# Altium schematic sheet dsPIC_filter.SchDoc
size B
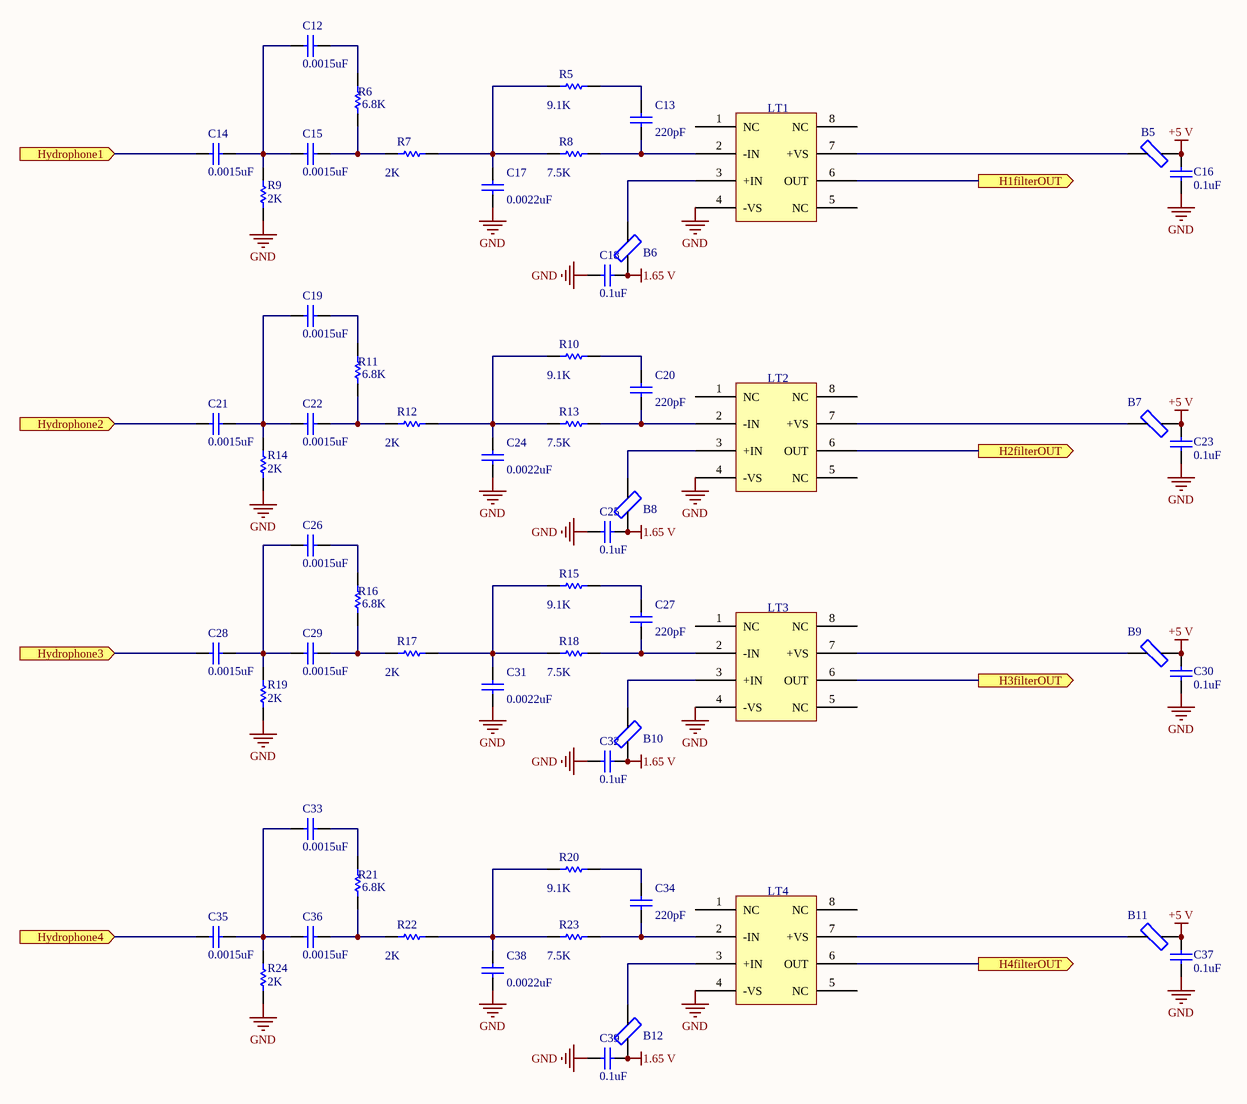
[diagram p0: dsPIC_filter.SchDoc]

## Parts
B5  Ferrite Bead  [Capacitor 0603]  (value not drawn)
B6  Ferrite Bead  [Capacitor 0603]  (value not drawn)
B7  Ferrite Bead  [Capacitor 0603]  (value not drawn)
B8  Ferrite Bead  [Capacitor 0603]  (value not drawn)
B9  Ferrite Bead  [Capacitor 0603]  (value not drawn)
B10  Ferrite Bead  [Capacitor 0603]  (value not drawn)
B11  Ferrite Bead  [Capacitor 0603]  (value not drawn)
B12  Ferrite Bead  [Capacitor 0603]  (value not drawn)
C12  0.0015uF  [Capacitor 0603]
C13  220pF  [Capacitor 0603]
C14  0.0015uF  [Capacitor 0603]
C15  0.0015uF  [Capacitor 0603]
C16  value 0.1uF  [C1206]  (hidden comment: .1uF 20V Ceramic Low ESR)
C17  0.0022uF  [Capacitor 0603]
C18  value 0.1uF  [C1206]  (hidden comment: .1uF 20V Ceramic Low ESR)
C19  0.0015uF  [Capacitor 0603]
C20  220pF  [Capacitor 0603]
C21  0.0015uF  [Capacitor 0603]
C22  0.0015uF  [Capacitor 0603]
C23  value 0.1uF  [C1206]  (hidden comment: .1uF 20V Ceramic Low ESR)
C24  0.0022uF  [Capacitor 0603]
C25  value 0.1uF  [C1206]  (hidden comment: .1uF 20V Ceramic Low ESR)
C26  0.0015uF  [Capacitor 0603]
C27  220pF  [Capacitor 0603]
C28  0.0015uF  [Capacitor 0603]
C29  0.0015uF  [Capacitor 0603]
C30  value 0.1uF  [C1206]  (hidden comment: .1uF 20V Ceramic Low ESR)
C31  0.0022uF  [Capacitor 0603]
C32  value 0.1uF  [C1206]  (hidden comment: .1uF 20V Ceramic Low ESR)
C33  0.0015uF  [Capacitor 0603]
C34  220pF  [Capacitor 0603]
C35  0.0015uF  [Capacitor 0603]
C36  0.0015uF  [Capacitor 0603]
C37  value 0.1uF  [C1206]  (hidden comment: .1uF 20V Ceramic Low ESR)
C38  0.0022uF  [Capacitor 0603]
C39  value 0.1uF  [C1206]  (hidden comment: .1uF 20V Ceramic Low ESR)
LT1  LT1677 SO8 Package  [SO8]  (value not drawn)
LT2  LT1677 SO8 Package  [SO8]  (value not drawn)
LT3  LT1677 SO8 Package  [SO8]  (value not drawn)
LT4  LT1677 SO8 Package  [SO8]  (value not drawn)
R5  9.1K  [Capacitor 0603]
R6  6.8K  [Capacitor 0603]
R7  2K  [Capacitor 0603]
R8  7.5K  [Capacitor 0603]
R9  2K  [Capacitor 0603]
R10  9.1K  [Capacitor 0603]
R11  6.8K  [Capacitor 0603]
R12  2K  [Capacitor 0603]
R13  7.5K  [Capacitor 0603]
R14  2K  [Capacitor 0603]
R15  9.1K  [Capacitor 0603]
R16  6.8K  [Capacitor 0603]
R17  2K  [Capacitor 0603]
R18  7.5K  [Capacitor 0603]
R19  2K  [Capacitor 0603]
R20  9.1K  [Capacitor 0603]
R21  6.8K  [Capacitor 0603]
R22  2K  [Capacitor 0603]
R23  7.5K  [Capacitor 0603]
R24  2K  [Capacitor 0603]

## Ports
H1filterOUT (out), H2filterOUT (out), H3filterOUT (out), H4filterOUT (out), Hydrophone1 (in), Hydrophone2 (in), Hydrophone3 (in), Hydrophone4 (in)

## Nets
1.65 V: B6.1 B8.1 B10.1 B12.1 C18.1 C25.1 C32.1 C39.1
+5 V: B5.1 B7.1 B9.1 B11.1 C16.1 C23.1 C30.1 C37.1
GND: C16.2 C17.1 C18.2 C23.2 C24.1 C25.2 C30.2 C31.1 C32.2 C37.2 C38.1 C39.2 LT1.4(-VS) LT2.4(-VS) LT3.4(-VS) LT4.4(-VS) R9.1 R14.1 R19.1 R24.1
H1filterOUT: LT1.6(OUT) ; port H1filterOUT
H2filterOUT: LT2.6(OUT) ; port H2filterOUT
H3filterOUT: LT3.6(OUT) ; port H3filterOUT
H4filterOUT: LT4.6(OUT) ; port H4filterOUT
Hydrophone1: C14.2 ; port Hydrophone1
Hydrophone2: C21.2 ; port Hydrophone2
Hydrophone3: C28.2 ; port Hydrophone3
Hydrophone4: C35.2 ; port Hydrophone4
NetB5_2: B5.2 LT1.7(+VS)
NetB6_2: B6.2 LT1.3(+IN)
NetB7_2: B7.2 LT2.7(+VS)
NetB8_2: B8.2 LT2.3(+IN)
NetB9_2: B9.2 LT3.7(+VS)
NetB10_2: B10.2 LT3.3(+IN)
NetB11_2: B11.2 LT4.7(+VS)
NetB12_2: B12.2 LT4.3(+IN)
NetC12_1: C12.1 R6.2
NetC12_2: C12.2 C14.1 C15.2 R9.2
NetC13_1: C13.1 LT1.2(-IN) R8.2
NetC13_2: C13.2 R5.2
NetC15_1: C15.1 R6.1 R7.1
NetC17_2: C17.2 R5.1 R7.2 R8.1
NetC19_1: C19.1 R11.2
NetC19_2: C19.2 C21.1 C22.2 R14.2
NetC20_1: C20.1 LT2.2(-IN) R13.2
NetC20_2: C20.2 R10.2
NetC22_1: C22.1 R11.1 R12.1
NetC24_2: C24.2 R10.1 R12.2 R13.1
NetC26_1: C26.1 R16.2
NetC26_2: C26.2 C28.1 C29.2 R19.2
NetC27_1: C27.1 LT3.2(-IN) R18.2
NetC27_2: C27.2 R15.2
NetC29_1: C29.1 R16.1 R17.1
NetC31_2: C31.2 R15.1 R17.2 R18.1
NetC33_1: C33.1 R21.2
NetC33_2: C33.2 C35.1 C36.2 R24.2
NetC34_1: C34.1 LT4.2(-IN) R23.2
NetC34_2: C34.2 R20.2
NetC36_1: C36.1 R21.1 R22.1
NetC38_2: C38.2 R20.1 R22.2 R23.1

Not connected (* = marked no-connect by the designer): LT1 1(NC) 5(NC) 8(NC); LT2 1(NC) 5(NC) 8(NC); LT3 1(NC) 5(NC) 8(NC); LT4 1(NC) 5(NC) 8(NC)

## Library data of the parts
B5-B12 = Ferrite Bead: Ferrite Bead: 200 Ohm @ 25 Mhz
C12-C15 C17 C19-C22 C24 C26-C29 C31 C33-C36 C38 = Cap: Capacitor; Published: 8-Jun-2000; LatestRevisionDate: 17-Jul-2002; LatestRevisionNote: Re-released for DXP Platform.; PackageReference: RAD-0.3; Publisher: Altium Limited; PackageDescription: Radial Cap, Thru-Hole; 2 Leads; 0.3 in Pin Spacing
  C12 C14 C15 C19 C21 C22 C26 C28 C29 C33 C35 C36: Value: 0.0015uF
  C13 C20 C27 C34: Value: 220pF
  C17 C24 C31 C38: Value: 0.0022uF
C16 C18 C23 C25 C30 C32 C37 C39 = Cap Semi: Capacitor (Semiconductor SIM Model); Published: 8-Jun-2000; LatestRevisionDate: 29-May-2009; LatestRevisionNote: IPC-7351 Footprint Added.; PackageReference: C1206; Publisher: Altium Limited; PackageDescription: Chip Capacitor
LT1-LT4 = LT1677
R5-R24 = Res1: Resistor; Published: 8-Jun-2000; LatestRevisionDate: 17-Jul-2002; LatestRevisionNote: Re-released for DXP Platform.; PackageReference: AXIAL-0.3; Publisher: Altium Limited; PackageDescription: Axial Device, Thru-Hole; 2 Leads; 0.3 in Pin Spacing
  R5 R10 R15 R20: Value: 9.1K
  R6 R11 R16 R21: Value: 6.8K
  R7 R9 R12 R14 R17 R19 R22 R24: Value: 2K
  R8 R13 R18 R23: Value: 7.5K